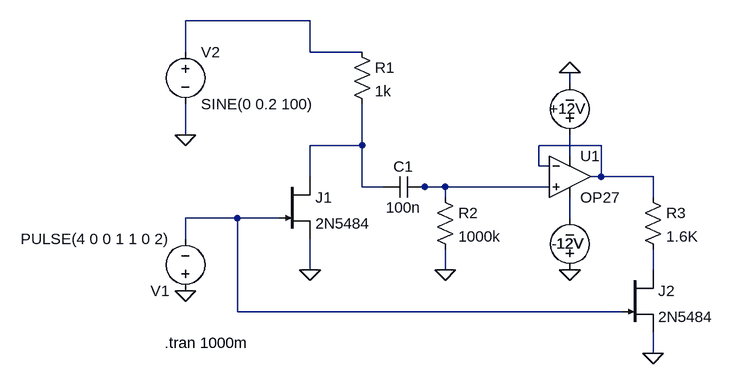
[diagram p0: schematic VCA dubbele jfet.asc]
VCA dubbele jfet.asc, the LTspice schematic file:
Version 4
SHEET 1 880 680
WIRE 192 -288 0 -288
WIRE 0 -240 0 -288
WIRE 192 -240 192 -288
WIRE 272 -240 192 -240
WIRE 592 -192 592 -208
WIRE 0 -112 0 -160
WIRE 272 -96 272 -160
WIRE 272 -96 192 -96
WIRE 640 -96 544 -96
WIRE 592 -80 592 -112
WIRE 544 -64 544 -96
WIRE 560 -64 544 -64
WIRE 192 -48 192 -96
WIRE 640 -48 640 -96
WIRE 640 -48 624 -48
WIRE 720 -48 640 -48
WIRE 272 -32 272 -96
WIRE 304 -32 272 -32
WIRE 368 -32 352 -32
WIRE 400 -32 368 -32
WIRE 560 -32 400 -32
WIRE 400 -16 400 -32
WIRE 720 -16 720 -48
WIRE 80 16 0 16
WIRE 144 16 80 16
WIRE 592 16 592 -16
WIRE 0 48 0 16
WIRE 192 96 192 48
WIRE 400 96 400 64
WIRE 720 96 720 64
WIRE 80 160 80 16
WIRE 672 160 80 160
WIRE 720 224 720 192
FLAG 0 128 0
FLAG 192 96 0
FLAG 0 -112 0
FLAG 720 224 0
FLAG 592 96 0
FLAG 592 -208 0
FLAG 400 96 0
SYMBOL voltage 0 144 R180
WINDOW 123 0 0 Left 0
WINDOW 39 0 0 Left 0
SYMATTR InstName V1
SYMATTR Value PULSE(4 0 0 1 1 0 2)
SYMBOL njf 144 -48 R0
SYMATTR InstName J1
SYMATTR Value 2N5484
SYMBOL res 256 -256 R0
SYMATTR InstName R1
SYMATTR Value 1k
SYMBOL voltage 0 -256 R0
WINDOW 123 24 44 Left 2
WINDOW 39 0 0 Left 0
SYMATTR InstName V2
SYMATTR Value SINE(0 0.2 100)
SYMBOL res 384 -32 R0
SYMATTR InstName R2
SYMATTR Value 1000k
SYMBOL cap 368 -48 R90
WINDOW 0 0 32 VBottom 2
WINDOW 3 32 32 VTop 2
SYMATTR InstName C1
SYMATTR Value 100n
SYMBOL njf 672 96 R0
SYMATTR InstName J2
SYMATTR Value 2N5484
SYMBOL OpAmps\\OP27 592 -112 R0
SYMATTR InstName U1
SYMBOL voltage 592 -96 R180
WINDOW 0 -25 57 Left 2
WINDOW 3 -25 57 Left 2
WINDOW 123 0 0 Left 0
WINDOW 39 0 0 Left 0
SYMATTR InstName +12V
SYMATTR Value 12V
SYMBOL voltage 592 112 R180
WINDOW 0 -23 57 Left 2
WINDOW 3 -22 57 Left 2
WINDOW 123 0 0 Left 0
WINDOW 39 0 0 Left 0
SYMATTR InstName -12V
SYMATTR Value 12V
SYMBOL res 704 -32 R0
SYMATTR InstName R3
SYMATTR Value 1.6K
TEXT -32 208 Left 2 !.tran 1000m

The netlist it stands for:
* VCA dubbele jfet.asc
V1 0 N006 PULSE(4 0 0 1 1 0 2)
J1 N002 N006 0 2N5484
R1 N001 N002 1k
V2 N001 0 SINE(0 0.2 100)
R2 N005 0 1000k
C1 N005 N002 100n
J2 N008 N006 0 2N5484
XU1 N005 N003 N004 N007 N003 OP27  ; pins In+ In- V+ V- OUT
V§+12V N004 0 12V
V§-12V 0 N007 12V
R3 N003 N008 1.6K
.model NJF NJF
.model PJF PJF
.lib standard.jft
.tran 1000m
.lib ADI.lib
.backanno
.end